# Altium schematic sheet Shy-Mirror-revA.SchDoc
size A4; SheetNumber: 1; SheetTotal: 1
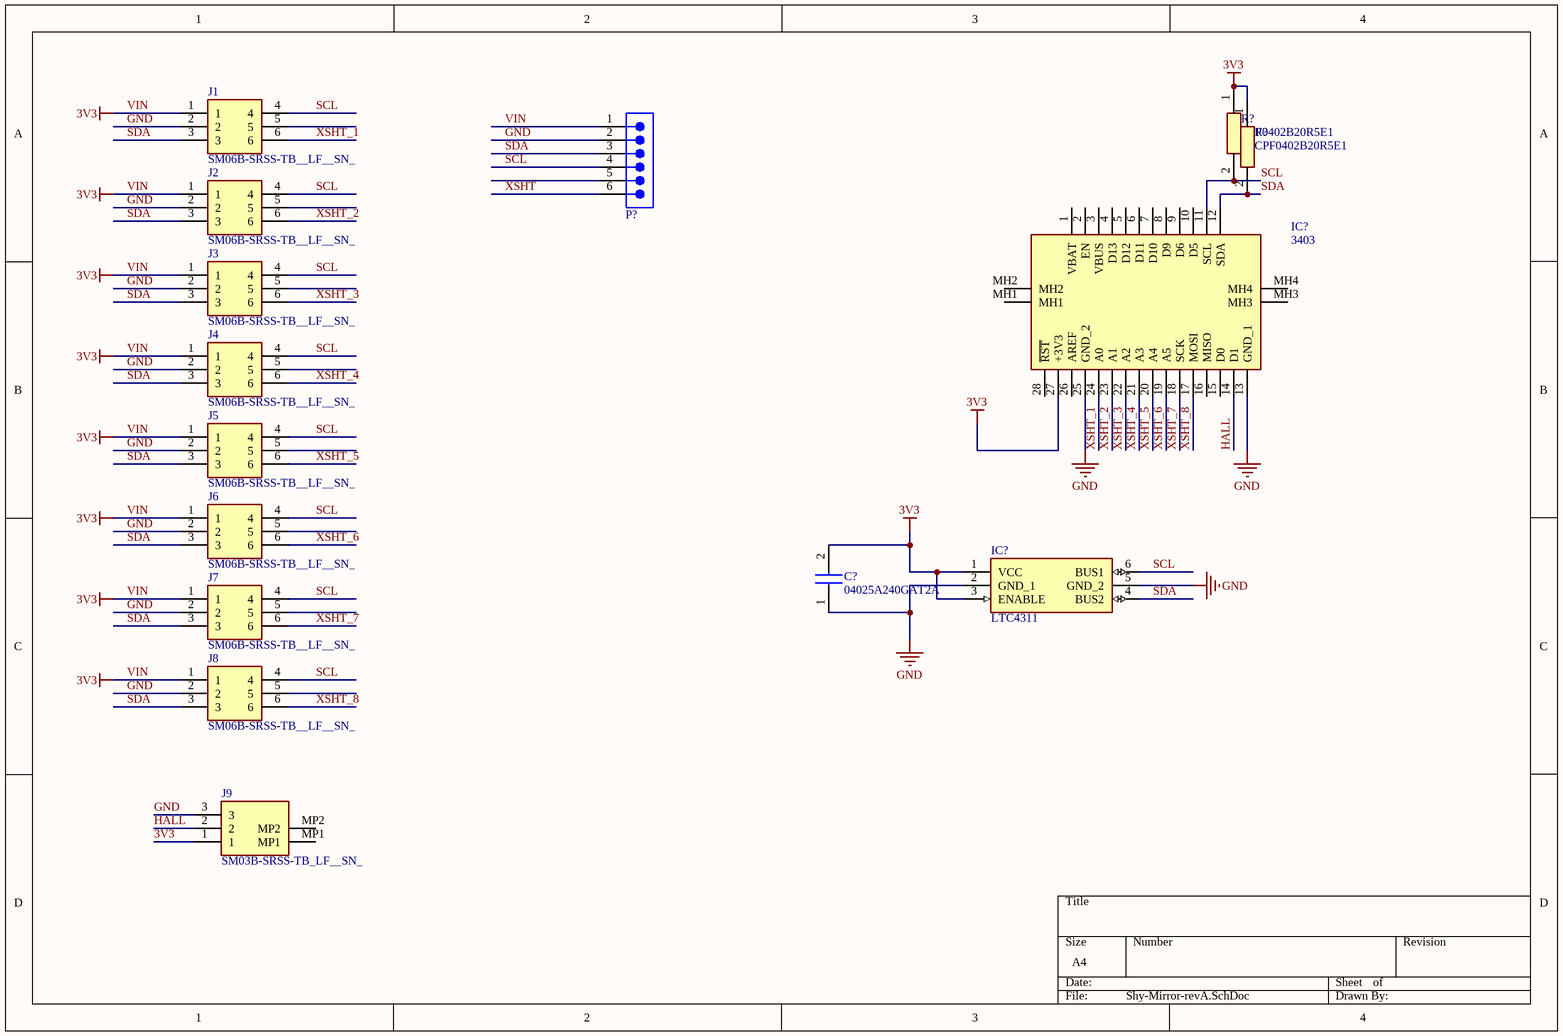
[diagram p0: Shy-Mirror-revA.SchDoc]

## Parts
(Parts that share a designator on the sheet are numbered #1, #2 ... from top to bottom, then left to right.)
C?  04025A240GAT2A  [CAPC1005X56N]
IC?#1  3403  [3403]
IC?#2  LTC4311  [SOP65P210X100-6N]
J1  SM06B-SRSS-TB__LF__SN_  [SM06B-SRSS-TB]
J2  SM06B-SRSS-TB__LF__SN_  [SM06B-SRSS-TB]
J3  SM06B-SRSS-TB__LF__SN_  [SM06B-SRSS-TB]
J4  SM06B-SRSS-TB__LF__SN_  [SM06B-SRSS-TB]
J5  SM06B-SRSS-TB__LF__SN_  [SM06B-SRSS-TB]
J6  SM06B-SRSS-TB__LF__SN_  [SM06B-SRSS-TB]
J7  SM06B-SRSS-TB__LF__SN_  [SM06B-SRSS-TB]
J8  SM06B-SRSS-TB__LF__SN_  [SM06B-SRSS-TB]
J9  SM03B-SRSS-TB_LF__SN_  [SM03BSRSSTBLFSN]
P?  62000611121  [62000611121]  (value not drawn)
R?#1  CPF0402B20R5E1  [RESC1005X35N]
R?#2  CPF0402B20R5E1  [RESC1005X35N]

## Nets
3V3: C?.2 IC?#1.27(+3V3) IC?#2.1(VCC) IC?#2.3(ENABLE) J1.1 J2.1 J3.1 J4.1 J5.1 J6.1 J7.1 J8.1 J9.1 P?.1 R?#1.1 R?#2.1  [also labelled VIN]
GND: C?.1 IC?#1.13(GND_1) IC?#1.25(GND_2) IC?#2.2(GND_1) IC?#2.5(GND_2) J1.2 J2.2 J3.2 J4.2 J5.2 J6.2 J7.2 J8.2 J9.3 P?.2
HALL: IC?#1.14(D1) J9.2
SCL: IC?#1.11(SCL) IC?#2.6(BUS1) J1.4 J2.4 J3.4 J4.4 J5.4 J6.4 J7.4 J8.4 P?.4 R?#1.2
SDA: IC?#1.12(SDA) IC?#2.4(BUS2) J1.3 J2.3 J3.3 J4.3 J5.3 J6.3 J7.3 J8.3 P?.3 R?#2.2
XSHT: P?.6
XSHT_1: IC?#1.24(A0) J1.6
XSHT_2: IC?#1.23(A1) J2.6
XSHT_3: IC?#1.22(A2) J3.6
XSHT_4: IC?#1.21(A3) J4.6
XSHT_5: IC?#1.20(A4) J5.6
XSHT_6: IC?#1.19(A5) J6.6
XSHT_7: IC?#1.18(SCK) J7.6
XSHT_8: IC?#1.17(MOSI) J8.6

Not connected (* = marked no-connect by the designer): IC?#1 1(VBAT) 2(EN) 3(VBUS) 4(D13) 5(D12) 6(D11) 7(D10) 8(D9) 9(D6) 10(D5) 15(D0) 16(MISO) 26(AREF) 28(~{RST}) MH1 MH2 MH3 MH4; J1 5; J2 5; J3 5; J4 5; J5 5; J6 5; J7 5; J8 5; J9 MP1 MP2; P? 5

## Library data of the parts
C? = 04025A240GAT2A: Capacitor; Manufacturer_Name: Kyocera AVX; Datasheet Link: http://www.mouser.com/catalog/supplier/library/pdf/AVXSurfaceMountCeramic.pdf; Height: 0.56mm; Manufacturer_Part_Number: 04025A240GAT2A; Mouser Part Number: 581-04025A240GAT2A; Mouser Price/Stock: https://www.mouser.co.uk/ProductDetail/AVX/04025A240GAT2A?qs=ZBeOGGPQgEEcxmEZelA7Mg%3D%3D
IC?#1 = 3403: Integrated Circuit; Manufacturer_Name: Adafruit; Datasheet Link: https://www.adafruit.com/product/3403; Height: 8mm; Manufacturer_Part_Number: 3403; Mouser Part Number: 485-3403; Mouser Price/Stock: https://www.mouser.co.uk/ProductDetail/Adafruit/3403?qs=5aG0NVq1C4wGaWnpUKWHHg%3D%3D; Arrow Part Number: 3403; Arrow Price/Stock: https://www.arrow.com/en/products/3403/adafruit-industries?region=nac
IC?#2 = LTC4311: Integrated Circuit; Manufacturer_Name: Analog Devices; Datasheet Link: http://cds.linear.com/docs/en/datasheet/4311fa.pdf; Height: 1mm; Manufacturer_Part_Number: LTC4311; Mouser Part Number: N/A; Mouser Price/Stock: https://www.mouser.co.uk/ProductDetail/Analog-Devices/LTC4311?qs=Imq1NPwxi76zvKPfOroLUg%3D%3D
J1-J8 = SM06B-SRSS-TB__LF__SN_: Connector; Manufacturer_Name: JST (JAPAN SOLDERLESS TERMINALS); Manufacturer_Part_Number: SM06B-SRSS-TB (LF)(SN); Datasheet Link: http://uk.rs-online.com/web/p/products/5468827
J9 = SM03B-SRSS-TB_LF__SN_: Connector; Manufacturer_Name: JST (JAPAN SOLDERLESS TERMINALS); Manufacturer_Part_Number: SM03B-SRSS-TB(LF)(SN); Datasheet Link: http://www.jst-mfg.com/product/pdf/eng/eSR.pdf; Height: 2.9mm; Mouser Part Number: 306-SM03BSRSSTBLFSNP; Mouser Price/Stock: https://www.mouser.co.uk/ProductDetail/JST-Commercial/SM03B-SRSS-TBLFSN?qs=cdbOS8ANM9DY%2Fg%2FPQv5Kng%3D%3D; Arrow Part Number: SM03B-SRSS-TB(LF)(SN); Arrow Price/Stock: https://www.arrow.com/en/products/sm03b-srss-tb-lf-sn/jst-manufacturing?region=europe
P? = 62000611121: WR-PHD Pin Header, THT, Vertical, pitch 2mm, 1 Row, 6P; Manufacturer: Wurth Elektronik; Contact Resistance: 20mOhm; Rated Current: 2A; Working Voltage: 200V; Withstanding Voltage: 500V; Manufacturer Part Number: 62000611121; Category: Board-to-Board Connectors; Match Code: WR-PHD; ComponentLink1Description: Website Link; ComponentLink1URL: https://www.we-online.com/redexpert/article/62000611121?ad; ComponentLink2Description: Datasheet Link; ComponentLink2URL: https://www.we-online.com/redexpert/spec/62000611121?ad; Mount: Through Hole; Operating Temperature Max: 105°C; Operating Temperature Min: -40°C; Packaging: Bag; Gender: Pin Header; Number of Pins: 6; Number of Rows: 1; Orientation: Vertical; Pitch: 2mm
R?#1 R?#2 = CPF0402B20R5E1: Resistor; Manufacturer_Name: TE Connectivity; Datasheet Link: http://www.farnell.com/datasheets/1786775.pdf; Height: 0.35mm; Manufacturer_Part_Number: CPF0402B20R5E1